# EAGLE schematic MC Brekout-SPInew (EAGLE 6.5.0)
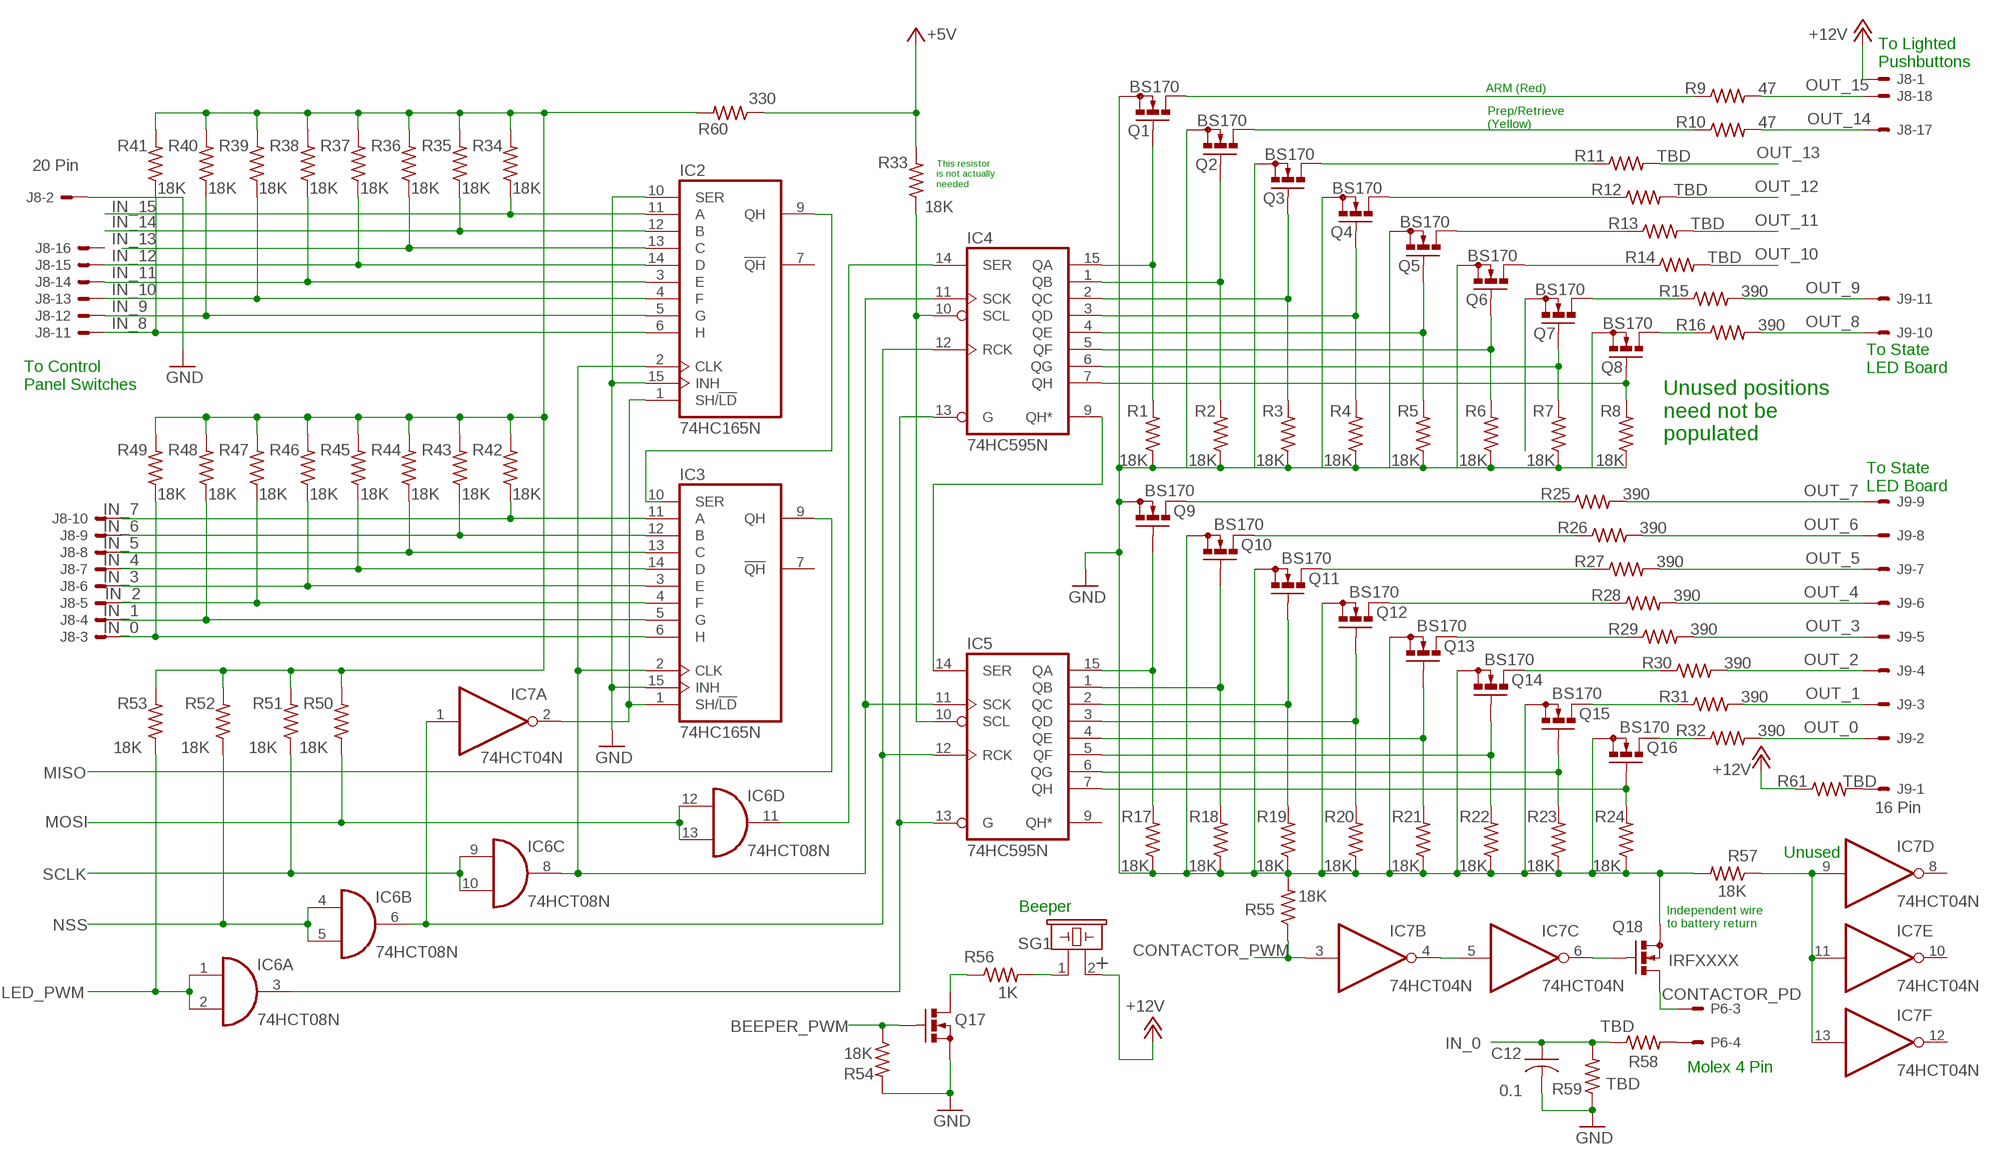
[diagram p0: schematic, sheet 1]

## Parts
C12  0.1  SMT0805  [SMT0805]
IC2  74HC165N  [DIL16]
IC3  74HC165N  [DIL16]
IC4  74HC595N  [DIL16]
IC5  74HC595N  [DIL16]
IC6  74HCT08N  [DIL14]
IC7  74HCT04N  [DIL14]
J8  20 Pin  C-GRID-20-70543  [70543-20]
J9  16 Pin  22-23-2121  [22-23-2121]
P6  Molex 4 Pin  22-23-2041  [22-23-2041]
Q1  BS170  [SOT54E]
Q2  BS170  [SOT54E]
Q3  BS170  [SOT54E]
Q4  BS170  [SOT54E]
Q5  BS170  [SOT54E]
Q6  BS170  [SOT54E]
Q7  BS170  [SOT54E]
Q8  BS170  [SOT54E]
Q9  BS170  [SOT54E]
Q10  BS170  [SOT54E]
Q11  BS170  [SOT54E]
Q12  BS170  [SOT54E]
Q13  BS170  [SOT54E]
Q14  BS170  [SOT54E]
Q15  BS170  [SOT54E]
Q16  BS170  [SOT54E]
Q17  BS170  [SOT54E]
Q18  IRFXXXX  BS170  [SOT54E]
R1  18K  R-US_V234/12  [V234/12]
R2  18K  R-US_V234/12  [V234/12]
R3  18K  R-US_V234/12  [V234/12]
R4  18K  R-US_V234/12  [V234/12]
R5  18K  R-US_V234/12  [V234/12]
R6  18K  R-US_V234/12  [V234/12]
R7  18K  R-US_V234/12  [V234/12]
R8  18K  R-US_V234/12  [V234/12]
R9  47  R-US_V234/12  [V234/12]
R10  47  R-US_V234/12  [V234/12]
R11  TBD  R-US_V234/12  [V234/12]
R12  TBD  R-US_V234/12  [V234/12]
R13  TBD  R-US_V234/12  [V234/12]
R14  TBD  R-US_V234/12  [V234/12]
R15  390  R-US_V234/12  [V234/12]
R16  390  R-US_V234/12  [V234/12]
R17  18K  R-US_V234/12  [V234/12]
R18  18K  R-US_V234/12  [V234/12]
R19  18K  R-US_V234/12  [V234/12]
R20  18K  R-US_V234/12  [V234/12]
R21  18K  R-US_V234/12  [V234/12]
R22  18K  R-US_V234/12  [V234/12]
R23  18K  R-US_V234/12  [V234/12]
R24  18K  R-US_V234/12  [V234/12]
R25  390  R-US_V234/12  [V234/12]
R26  390  R-US_V234/12  [V234/12]
R27  390  R-US_V234/12  [V234/12]
R28  390  R-US_V234/12  [V234/12]
R29  390  R-US_V234/12  [V234/12]
R30  390  R-US_V234/12  [V234/12]
R31  390  R-US_V234/12  [V234/12]
R32  390  R-US_V234/12  [V234/12]
R33  18K  R-US_V234/12  [V234/12]
R34  18K  R-US_V234/12  [V234/12]
R35  18K  R-US_V234/12  [V234/12]
R36  18K  R-US_V234/12  [V234/12]
R37  18K  R-US_V234/12  [V234/12]
R38  18K  R-US_V234/12  [V234/12]
R39  18K  R-US_V234/12  [V234/12]
R40  18K  R-US_V234/12  [V234/12]
R41  18K  R-US_V234/12  [V234/12]
R42  18K  R-US_V234/12  [V234/12]
R43  18K  R-US_V234/12  [V234/12]
R44  18K  R-US_V234/12  [V234/12]
R45  18K  R-US_V234/12  [V234/12]
R46  18K  R-US_V234/12  [V234/12]
R47  18K  R-US_V234/12  [V234/12]
R48  18K  R-US_V234/12  [V234/12]
R49  18K  R-US_V234/12  [V234/12]
R50  18K  R-US_V234/12  [V234/12]
R51  18K  R-US_V234/12  [V234/12]
R52  18K  R-US_V234/12  [V234/12]
R53  18K  R-US_V234/12  [V234/12]
R54  18K  R-US_V234/12  [V234/12]
R55  18K  R-US_V234/12  [V234/12]
R56  1K  R-US_V234/12  [V234/12]
R57  18K  R-US_V234/12  [V234/12]
R58  TBD  R-US_V234/12  [V234/12]
R59  TBD  R-US_V234/12  [V234/12]
R60  330  R-US_V234/12  [V234/12]
R61  TBD  R-US_V234/12  [V234/12]
SG1  EFBAA40D101  [EFBAA40D101]

## Nets
+5V: R33.2 R60.1
+12V: J8.1 R61.1 SG1.2
BEEPER_PWM: Q17.G R54.1
CONTACTOR_PD: P6.3 Q18.D
CONTACTOR_PWM: IC7.3(B:I) R55.1
GND: C12.P$2 IC2.10(SER) IC2.15(INH) IC3.15(INH) J8.2 Q1.S Q9.S Q10.S Q11.S Q12.S Q13.S Q14.S Q15.S Q16.S Q17.S Q18.S R1.1 R2.1 R3.1 R4.1 R5.1 R6.1 R7.1 R8.1 R17.1 R18.1 R19.1 R20.1 R21.1 R22.1 R23.1 R24.1 R54.2 R55.2 R57.2 R59.1
IN_0: C12.P$1 IC3.6(H) J8.3 R49.1 R58.1 R59.2
IN_1: IC3.5(G) J8.4 R48.1
IN_2: IC3.4(F) J8.5 R47.1
IN_3: IC3.3(E) J8.6 R46.1
IN_4: IC3.14(D) J8.7 R45.1
IN_5: IC3.13(C) J8.8 R44.1
IN_6: IC3.12(B) J8.9 R43.1
IN_7: IC3.11(A) J8.10 R42.1
IN_8: IC2.6(H) J8.11 R41.1
IN_9: IC2.5(G) J8.12 R40.1
IN_10: IC2.4(F) J8.13 R39.1
IN_11: IC2.3(E) J8.14 R38.1
IN_12: IC2.14(D) J8.15 R37.1
IN_13: IC2.13(C) R36.1
IN_14: IC2.12(B) R35.1
IN_15: IC2.11(A) R34.1
LED_PWM: IC6.1(A:I0) IC6.2(A:I1) R53.1
MISO: IC3.9(QH)
MOSI: IC6.12(D:I0) IC6.13(D:I1) R50.1
N$1: P6.4 R58.2
N$2: Q8.S
N$3: IC4.1(QB) Q2.G R2.2
N$4: IC4.2(QC) Q3.G R3.2
N$5: IC4.3(QD) Q4.G R4.2
N$6: IC4.4(QE) Q5.G R5.2
N$7: IC5.1(QB) Q10.G R18.2
N$8: IC4.6(QG) Q7.G R7.2
N$9: IC4.7(QH) Q8.G R8.2
N$10: Q1.D R9.1
N$11: Q2.D R10.1
N$12: Q3.D R11.1
N$13: Q4.D R12.1
N$14: Q5.D R13.1
N$15: Q6.D R14.1
N$16: Q7.D R15.1
N$17: Q8.D R16.1
N$18: IC4.9(QH*) IC5.14(SER)
N$19: IC5.2(QC) Q11.G R19.2
N$20: IC5.3(QD) Q12.G R20.2
N$21: IC7.9(D:I) IC7.11(E:I) IC7.13(F:I) R57.1
N$22: R56.2 SG1.1
N$23: IC4.5(QF) Q6.G R6.2
N$24: IC4.15(QA) Q1.G R1.2
N$25: IC5.4(QE) Q13.G R21.2
N$26: IC5.6(QG) Q15.G R23.2
N$27: IC5.7(QH) Q16.G R24.2
N$28: Q9.D R25.1
N$29: Q10.D R26.1
N$30: Q11.D R27.1
N$31: Q12.D R28.1
N$32: Q13.D R29.1
N$33: Q14.D R30.1
N$34: Q15.D R31.1
N$35: IC2.9(QH) IC3.10(SER)
N$36: Q16.D R32.1
N$37: IC5.5(QF) Q14.G R22.2
N$38: IC5.15(QA) Q9.G R17.2
N$39: Q17.D R56.1
N$40: IC7.4(B:O) IC7.5(C:I)
N$41: IC7.6(C:O) Q18.G
N$42: Q2.S
N$43: Q3.S
N$44: Q4.S
N$45: Q5.S
N$46: Q6.S
N$47: Q7.S
N$48: IC2.1(SH/!LD) IC3.1(SH/!LD) IC7.2(A:O)
N$49: R34.2 R35.2 R36.2 R37.2 R38.2 R39.2 R40.2 R41.2 R42.2 R43.2 R44.2 R45.2 R46.2 R47.2 R48.2 R49.2 R50.2 R51.2 R52.2 R53.2 R60.2
N$50: J9.1 R61.2
N$56: IC2.2(CLK) IC3.2(CLK) IC4.11(SCK) IC5.11(SCK) IC6.8(C:O)
N$57: IC4.14(SER) IC6.11(D:O)
N$58: IC4.10(SCL) IC5.10(SCL) R33.1
N$59: IC4.12(RCK) IC5.12(RCK) IC6.6(B:O) IC7.1(A:I)
N$60: IC4.13(G) IC5.13(G) IC6.3(A:O)
NSS: IC6.4(B:I0) IC6.5(B:I1) R52.1
OUT_0: J9.2 R32.2
OUT_1: J9.3 R31.2
OUT_2: J9.4 R30.2
OUT_3: J9.5 R29.2
OUT_4: J9.6 R28.2
OUT_5: J9.7 R27.2
OUT_6: J9.8 R26.2
OUT_7: J9.9 R25.2
OUT_8: J9.10 R16.2
OUT_9: J9.11 R15.2
OUT_10: R14.2
OUT_11: R13.2
OUT_12: R12.2
OUT_13: R11.2
OUT_14: J8.17 R10.2
OUT_15: J8.18 R9.2
SCLK: IC6.9(C:I0) IC6.10(C:I1) R51.1
Unconnected: IC2.7(!QH) IC3.7(!QH) IC5.9(QH*) IC7.8(D:O) IC7.10(E:O) IC7.12(F:O) J8.16 J8.19 J8.20 J9.12 P6.1 P6.2

## Notes on the sheet
- To Lighted
  Pushbuttons
- ARM (Red)
- Prep/Retrieve
  (Yellow)
- This resistor 
  is not actually
  needed
- To State
  LED Board
- To Control
  Panel Switches
- Unused positions
  need not be 
  populated
- To State
  LED Board
- Unused
- Beeper
- Independent wire
  to battery return
- +
- Molex 4 Pin

## Power pins joined to a net without a drawn wire
GND: IC2.8(GND) IC3.8(GND) IC4.8(GND) IC5.8(GND) IC6.7(P:GND) IC7.7(P:GND)
VCC: IC2.16(VCC) IC3.16(VCC) IC4.16(VCC) IC5.16(VCC) IC6.14(P:VCC) IC7.14(P:VCC)

## Library data of the parts
C12 = deh:SMT0805
IC2 IC3 = 74xx-eu:74*165: 8-bit parallel load SHIFT REGISTER
IC4 IC5 = 74xx-eu:74*595: 8-bit SHIFT REGISTER, output latch
IC6 = 74xx-eu:74*08: Quad 2-input AND gate
IC7 = 74xx-eu:74*04: Hex INVERTER
J8 = con-molex:C-GRID-20: CONNECTOR wire to board 2.54 mm (0.100") pitch header; OC_FARNELL: unknown; OC_NEWARK: unknown
J9 = con-molex:22-23-2121: .100" (2.54mm) Center Header - 12 Pin; MF: MOLEX; MPN: 22-23-2121; OC_FARNELL: 1462935; OC_NEWARK: 56H0456
P6 = con-molex:22-23-2041: .100" (2.54mm) Center Header - 4 Pin; MF: MOLEX; MPN: 22-23-2041; OC_FARNELL: 1462920; OC_NEWARK: 38C0355
Q1-Q18 = transistor-small-signal:BS170: N-CHANNEL MOS FET
R1-R61 = resistor:R-US_: RESISTOR, American symbol
SG1 = buzzer:EFB?: Piezoelectric Acoustic Transducer Source: Panbasonic .. 2SC1685.pdf; OC_FARNELL: unknown; OC_NEWARK: unknown